# EAGLE schematic ESC (EAGLE 9.6.2)
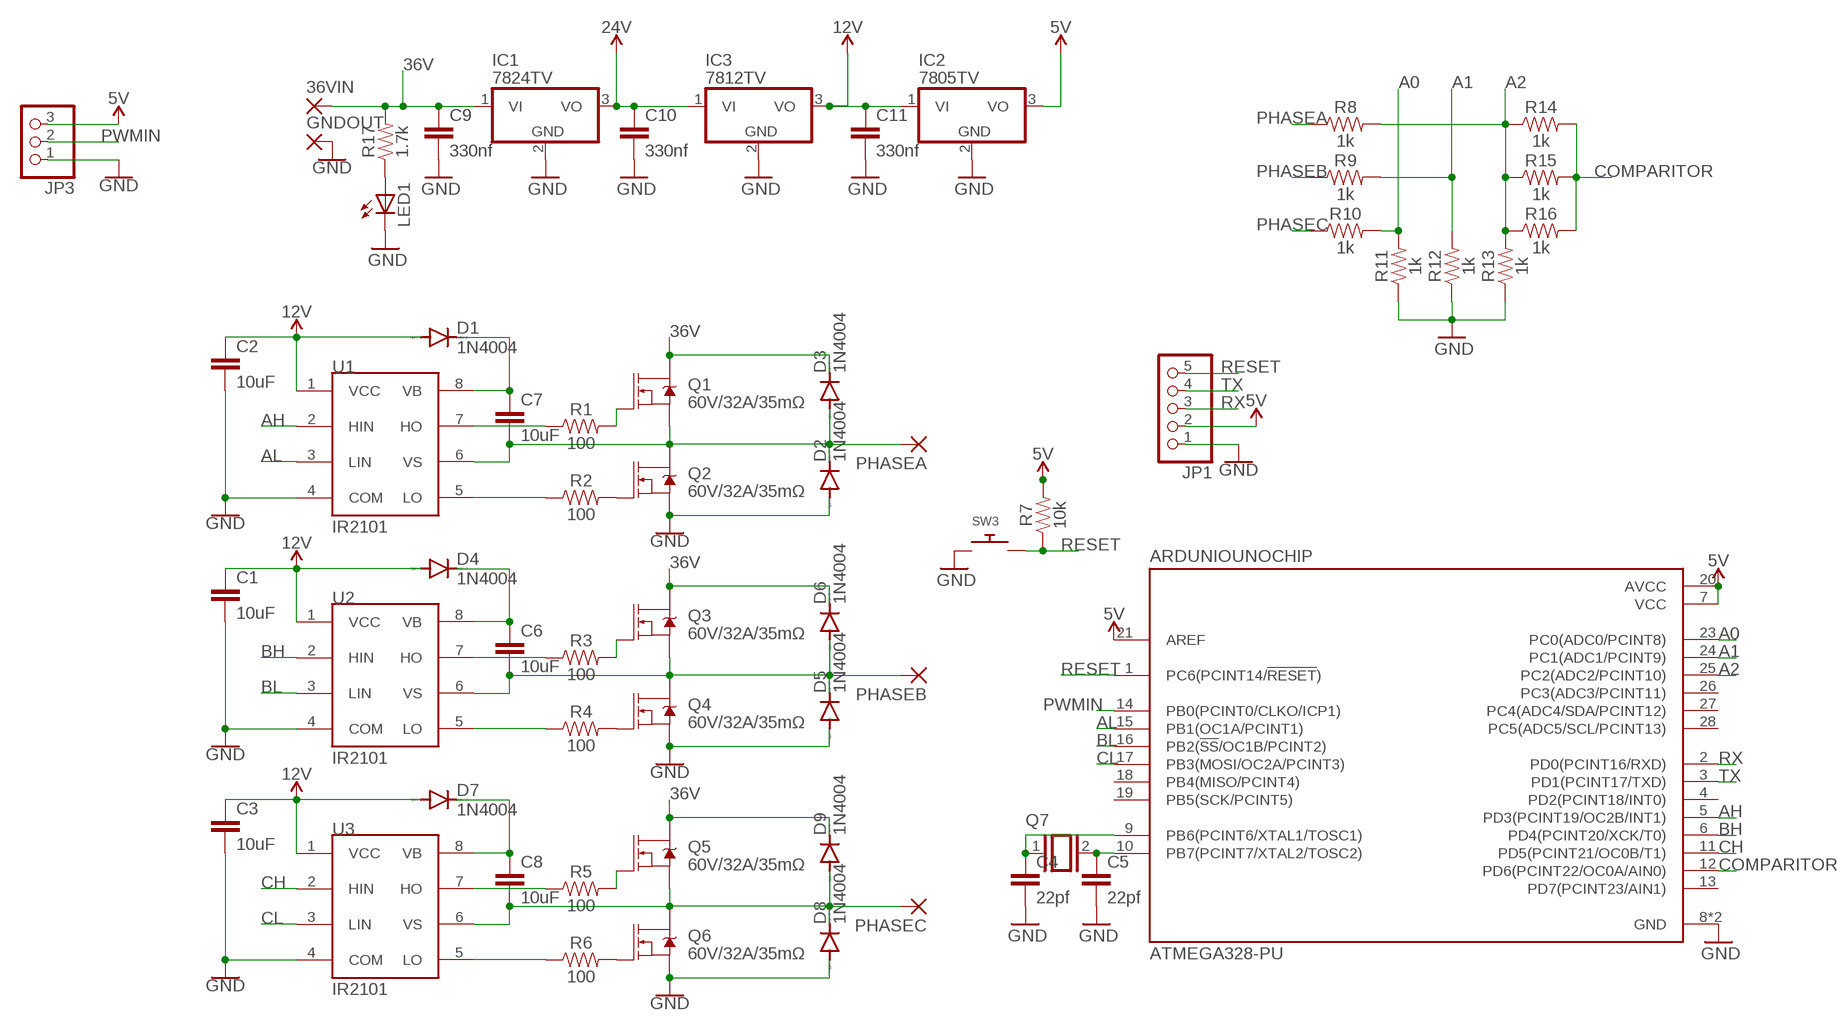
[diagram p0: schematic, sheet 1]

## Parts
36VIN  2,15/1,0  [2,15/1,0]
ARDUNIOUNOCHIP  ATMEGA328-PU  [DIP787W46P254L3467H508Q28]
C1  10uF  10NF-PTH-10MM-10000V-1-%  [CAP-PTH-10MM]
C2  10uF  10NF-PTH-10MM-10000V-1-%  [CAP-PTH-10MM]
C3  10uF  10NF-PTH-10MM-10000V-1-%  [CAP-PTH-10MM]
C4  22pf  10NF-PTH-10MM-10000V-1-%  [CAP-PTH-10MM]
C5  22pf  10NF-PTH-10MM-10000V-1-%  [CAP-PTH-10MM]
C6  10uF  10NF-PTH-10MM-10000V-1-%  [CAP-PTH-10MM]
C7  10uF  10NF-PTH-10MM-10000V-1-%  [CAP-PTH-10MM]
C8  10uF  10NF-PTH-10MM-10000V-1-%  [CAP-PTH-10MM]
C9  330nf  10NF-PTH-10MM-10000V-1-%  [CAP-PTH-10MM]
C10  330nf  10NF-PTH-10MM-10000V-1-%  [CAP-PTH-10MM]
C11  330nf  10NF-PTH-10MM-10000V-1-%  [CAP-PTH-10MM]
D1  1N4004  [DO41-10]
D2  1N4004  [DO41-10]
D3  1N4004  [DO41-10]
D4  1N4004  [DO41-10]
D5  1N4004  [DO41-10]
D6  1N4004  [DO41-10]
D7  1N4004  [DO41-10]
D8  1N4004  [DO41-10]
D9  1N4004  [DO41-10]
GNDOUT  2,15/1,0  [2,15/1,0]
IC1  7824TV  [TO220V]
IC2  7805TV  [TO220V]
IC3  7812TV  7805TV  [TO220V]
JP1  PINHD-1X5  [1X05]
JP3  PINHD-1X3  [1X03]
LED1  LED5MM  [LED5MM]
PHASEA  2,15/1,0  [2,15/1,0]
PHASEB  2,15/1,0  [2,15/1,0]
PHASEC  2,15/1,0  [2,15/1,0]
Q1  60V/32A/35mΩ  MOSFET-NCH-FQP30N06L  [TO220V]
Q2  60V/32A/35mΩ  MOSFET-NCH-FQP30N06L  [TO220V]
Q3  60V/32A/35mΩ  MOSFET-NCH-FQP30N06L  [TO220V]
Q4  60V/32A/35mΩ  MOSFET-NCH-FQP30N06L  [TO220V]
Q5  60V/32A/35mΩ  MOSFET-NCH-FQP30N06L  [TO220V]
Q6  60V/32A/35mΩ  MOSFET-NCH-FQP30N06L  [TO220V]
Q7  XTAL/S  [QS]
R1  100  1MOHM-HORIZ-1/4W-5%  [AXIAL-0.3]
R2  100  1MOHM-HORIZ-1/4W-5%  [AXIAL-0.3]
R3  100  1MOHM-HORIZ-1/4W-5%  [AXIAL-0.3]
R4  100  1MOHM-HORIZ-1/4W-5%  [AXIAL-0.3]
R5  100  1MOHM-HORIZ-1/4W-5%  [AXIAL-0.3]
R6  100  1MOHM-HORIZ-1/4W-5%  [AXIAL-0.3]
R7  10k  10KOHM-HORIZ-1/4W-1%  [AXIAL-0.3]
R8  1k  1KOHM-HORIZ-1/4W-1%  [AXIAL-0.3]
R9  1k  1KOHM-HORIZ-1/4W-1%  [AXIAL-0.3]
R10  1k  1KOHM-HORIZ-1/4W-1%  [AXIAL-0.3]
R11  1k  1KOHM-HORIZ-1/4W-1%  [AXIAL-0.3]
R12  1k  1KOHM-HORIZ-1/4W-1%  [AXIAL-0.3]
R13  1k  1KOHM-HORIZ-1/4W-1%  [AXIAL-0.3]
R14  1k  1KOHM-HORIZ-1/4W-1%  [AXIAL-0.3]
R15  1k  1KOHM-HORIZ-1/4W-1%  [AXIAL-0.3]
R16  1k  1KOHM-HORIZ-1/4W-1%  [AXIAL-0.3]
R17  1.7k  1KOHM-HORIZ-1/4W-1%  [AXIAL-0.3]
SW3  SWITCH_PUSHBUTTONEVQ-PE  [TACT_PANA-EVQ]
U1  IR2101  [DIL08]
U2  IR2101  [DIL08]
U3  IR2101  [DIL08]

## Nets
5V: ARDUNIOUNOCHIP.7(VCC) ARDUNIOUNOCHIP.20(AVCC) ARDUNIOUNOCHIP.21(AREF) IC2.3(VO) JP1.2 JP3.3 R7.P$2
12V: C10.1 IC1.3(VO) IC3.1(VI) ; supply symbol labelled 24V
36V: 36VIN.1(P) C9.1 D3.C D6.C D9.C IC1.1(VI) Q1.2(D) Q3.2(D) Q5.2(D) R17.P$2
A0: ARDUNIOUNOCHIP.23(PC0(ADC0/PCINT8)) R10.P$2 R11.P$2
A1: ARDUNIOUNOCHIP.24(PC1(ADC1/PCINT9)) R9.P$2 R12.P$2
A2: ARDUNIOUNOCHIP.25(PC2(ADC2/PCINT10)) R8.P$2 R13.P$2 R14.P$1 R15.P$1 R16.P$1
AH: ARDUNIOUNOCHIP.5(PD3(PCINT19/OC2B/INT1)) U1.2(HIN)
AL: ARDUNIOUNOCHIP.15(PB1(OC1A/PCINT1)) U1.3(LIN)
BH: ARDUNIOUNOCHIP.6(PD4(PCINT20/XCK/T0)) U2.2(HIN)
BL: ARDUNIOUNOCHIP.16(PB2(!SS!/OC1B/PCINT2)) U2.3(LIN)
CH: ARDUNIOUNOCHIP.11(PD5(PCINT21/OC0B/T1)) U3.2(HIN)
CL: ARDUNIOUNOCHIP.17(PB3(MOSI/OC2A/PCINT3)) U3.3(LIN)
COMPARITOR: ARDUNIOUNOCHIP.12(PD6(PCINT22/OC0A/AIN0)) R14.P$2 R15.P$2 R16.P$2
GND: ARDUNIOUNOCHIP.8(GND) ARDUNIOUNOCHIP.22(GND) C1.2 C2.2 C3.2 C4.2 C5.2 C9.2 C10.2 C11.2 D2.A D5.A D8.A GNDOUT.1(P) IC1.2(GND) IC2.2(GND) IC3.2(GND) JP1.1 JP3.1 LED1.K(C) Q2.3(S) Q4.3(S) Q6.3(S) R11.P$1 R12.P$1 R13.P$1 SW3.P$1 U1.4(COM) U2.4(COM) U3.4(COM)
N$1: ARDUNIOUNOCHIP.9(PB6(PCINT6/XTAL1/TOSC1)) C4.1 Q7.1
N$2: Q3.1(G) R3.P$2
N$3: Q2.1(G) R2.P$2
N$4: Q1.1(G) R1.P$2
N$5: LED1.A R17.P$1
N$6: R2.P$1 U1.5(LO)
N$7: R1.P$1 U1.7(HO)
N$9: Q4.1(G) R4.P$2
N$10: R4.P$1 U2.5(LO)
N$11: R3.P$1 U2.7(HO)
N$12: Q5.1(G) R5.P$2
N$14: Q6.1(G) R6.P$2
N$15: R6.P$1 U3.5(LO)
N$16: R5.P$1 U3.7(HO)
N$17: ARDUNIOUNOCHIP.10(PB7(PCINT7/XTAL2/TOSC2)) C5.1 Q7.2
PHASEA: C7.2 D2.C D3.A PHASEA.1(P) Q1.3(S) Q2.2(D) R8.P$1 U1.6(VS)
PHASEB: C6.2 D5.C D6.A PHASEB.1(P) Q3.3(S) Q4.2(D) R9.P$1 U2.6(VS)
PHASEC: C8.2 D8.C D9.A PHASEC.1(P) Q5.3(S) Q6.2(D) R10.P$1 U3.6(VS)
PWMIN: ARDUNIOUNOCHIP.14(PB0(PCINT0/CLKO/ICP1)) JP3.2
RESET: ARDUNIOUNOCHIP.1(PC6(PCINT14/!RESET!)) JP1.5 R7.P$1 SW3.P$2
RX: ARDUNIOUNOCHIP.2(PD0(PCINT16/RXD)) JP1.3
TX: ARDUNIOUNOCHIP.3(PD1(PCINT17/TXD)) JP1.4
VB: C6.1 C7.1 C8.1 D1.C D4.C D7.C U1.8(VB) U2.8(VB) U3.8(VB)
VCC: C1.1 C2.1 C3.1 C11.1 D1.A D4.A D7.A IC2.1(VI) IC3.3(VO) U1.1(VCC) U2.1(VCC) U3.1(VCC) ; supply symbol labelled 12V
Unconnected: ARDUNIOUNOCHIP.4(PD2(PCINT18/INT0)) ARDUNIOUNOCHIP.13(PD7(PCINT23/AIN1)) ARDUNIOUNOCHIP.18(PB4(MISO/PCINT4)) ARDUNIOUNOCHIP.19(PB5(SCK/PCINT5)) ARDUNIOUNOCHIP.26(PC3(ADC3/PCINT11)) ARDUNIOUNOCHIP.27(PC4(ADC4/SDA/PCINT12)) ARDUNIOUNOCHIP.28(PC5(ADC5/SCL/PCINT13))

## Library data of the parts
36VIN GNDOUT PHASEA PHASEB PHASEC = wirepad:2,15/1,0: THROUGH-HOLE PAD
ARDUNIOUNOCHIP = ATMEGA328-PU:ATMEGA328-PU: Check availability <https://pricing.snapeda.com/parts/ATMEGA328-PU/Microchip%20Technology/view-part?ref=eda>; AVAILABILITY: In Stock; CHECK_PRICES: https://www.snapeda.com/parts/ATMEGA328-PU/Microchip/view-part/?ref=eda; DESCRIPTION: AVR AVR® ATmega Microcontroller IC 8-Bit 20MHz 32KB (16K x 16) FLASH 28-PDIP; MF: Microchip Technology; MP: ATMEGA328-PU; PACKAGE: DIP-28 Microchip Technology; PRICE: None; PURCHASE-URL: https://www.snapeda.com/api/url_track_click_mouser/?unipart_id=4833845&manufacturer=Microchip Technology&part_name=ATMEGA328-PU&search_term=None; SNAPEDA_LINK: https://www.snapeda.com/parts/ATMEGA328-PU/Microchip/view-part/?ref=snap
C1-C11 = SparkFun-Capacitors:10NF: 0.01uF/10nF/10,000pF ceramic capacitors A capacitor is a passive two-terminal electrical component used to store electrical energy temporarily in an electric field. CAP-09321; PROD_ID: CAP-09321; VALUE: 10nF
D1-D9 = diode:1N4004: DIODE general purpose rectifier, 1 A
IC1-IC3 = linear:78*: Positive VOLTAGE REGULATOR Source: http://cache.national.com/ds/LM/LM78L05.pdf http://www.fairchildsemi.com/ds/LM/LM7805.pdf
JP1 = pinhead:PINHD-1X5: PIN HEADER
JP3 = pinhead:PINHD-1X3: PIN HEADER
LED1 = adafruit:LED: LED OSRAM: - CHIPLED LG R971, LG N971, LY N971, LG Q971, LY Q971, LO R971, LY R971 LH N974, LH R974 LS Q976, LO Q976, LY Q976 LO Q996 - Hyper CHIPLED LW Q18S LB Q993, LB Q99A, LB R99A - SideLED LS A670, LO A670, LY A670, LG A670, LP A670 LB A673, LV A673, LT A673, LW A673 LH A674 LY A675 LS A676, LA A676, LO A676, LY A676, LW A676 LS A679, LY A679, LG A679 - Hyper Micro SIDELED® LS Y876, LA Y876, LO Y876, LY Y876 LT Y87S - SmartLED LW L88C, LW L88S LB L89C, LB L89S, LG L890 LS L89K, LO L89K, LY L89K LS L896, LA L896, LO L896, LY L896 - TOPLED LS T670, LO T670, LY T670, LG T670, LP T670 LSG T670, LSP T670, LSY T670, LOP T670, LYG T670 LG T671, LOG T671, LSG T671 LB T673, LV T673, LT T673, LW T673 LH T674 LS T676, LA T676, LO T676, LY T676, LB T676, LH T676, LSB T676, LW T676 LB T67C, LV T67C, LT T67C, LS T67K, LO T67K, LY T67K, LW E67C LS E67B, LA E67B, LO E67B, LY E67B, LB E67C, LV E67C, LT E67C LW T67C LS T679, LY T679, LG T679 LS T770, LO T770, LY T770, LG T770, LP T770 LB T773, LV T773, LT T773, LW T773 LH T774 LS E675, LA E675, LY E675, LS T675 LS T776, LA T776, LO T776, LY T776, LB T776 LHGB T686 LT T68C, LB T68C - Hyper Mini TOPLED® LB M676 - Mini TOPLED Santana® LG M470 LS M47K, LO M47K, LY M47K Source: http://www.osram.convergy.de/
Q1-Q6 = SparkFun-DiscreteSemi:MOSFET-NCH: N-channel MOSFETs Voltage controlled devices that allow control of high current outputs. SparkFun Products: SparkFun OpenScale <https://www.sparkfun.com/products/13261> SparkFun Digital Sandbox <https://www.sparkfun.com/products/12651> SparkFun Monster Moto Shield <https://www.sparkfun.com/products/10182> SparkFun MOSFET Power Controller <https://www.sparkfun.com/products/11214>; PROD_ID: TRANS-10060
Q7 = special:XTAL/S: CRYSTAL
R1-R6 = SparkFun-Resistors:1MOHM: 1MΩ resistor A resistor is a passive two-terminal electrical component that implements electrical resistance as a circuit element. Resistors act to reduce current flow, and, at the same time, act to lower voltage levels within circuits. - Wikipedia; PROD_ID: RES-09329; VALUE: 1M
R7 = SparkFun-Resistors:10KOHM: 10kΩ resistor A resistor is a passive two-terminal electrical component that implements electrical resistance as a circuit element. Resistors act to reduce current flow, and, at the same time, act to lower voltage levels within circuits. - Wikipedia; PROD_ID: RES-12183
R8-R16 = SparkFun-Resistors:1KOHM: 1kΩ resistor A resistor is a passive two-terminal electrical component that implements electrical resistance as a circuit element. Resistors act to reduce current flow, and, at the same time, act to lower voltage levels within circuits. - Wikipedia; PROD_ID: RES-12182
R17 = SparkFun-Resistors:1KOHM: 1kΩ resistor A resistor is a passive two-terminal electrical component that implements electrical resistance as a circuit element. Resistors act to reduce current flow, and, at the same time, act to lower voltage levels within circuits. - Wikipedia; PROD_ID: RES-12182; VALUE: 1k
SW3 = adafruit:SWITCH_PUSHBUTTON: Buttons SOFTTOUCHSMD_SJ - Soft touch temporary push button (Super Junk Akihabara) Compatible with SKPMANE010 [Mouser: 688-SKPMAN] C&K_KSS = Digikey: KSS221GLFS
U1-U3 = IR2101:IR2101: High and low side driver Check availability <https://pricing.snapeda.com/parts/IR2101/Infineon/view-part?ref=eda>; AVAILABILITY: In Stock; CHECK_PRICES: https://www.snapeda.com/parts/IR2101/Infineon+Technologies/view-part/?ref=eda; DESCRIPTION: Half-Bridge Gate Driver IC Non-Inverting 8-PDIP; MF: Infineon; MP: IR2101; PACKAGE: DIP-8 International Rectifier; PRICE: None; PURCHASE-URL: https://www.snapeda.com/api/url_track_click_mouser/?unipart_id=41866&manufacturer=Infineon&part_name=IR2101&search_term=None; SNAPEDA_LINK: https://www.snapeda.com/parts/IR2101/Infineon+Technologies/view-part/?ref=snap